# Altium project flyback_desing.PrjPcb
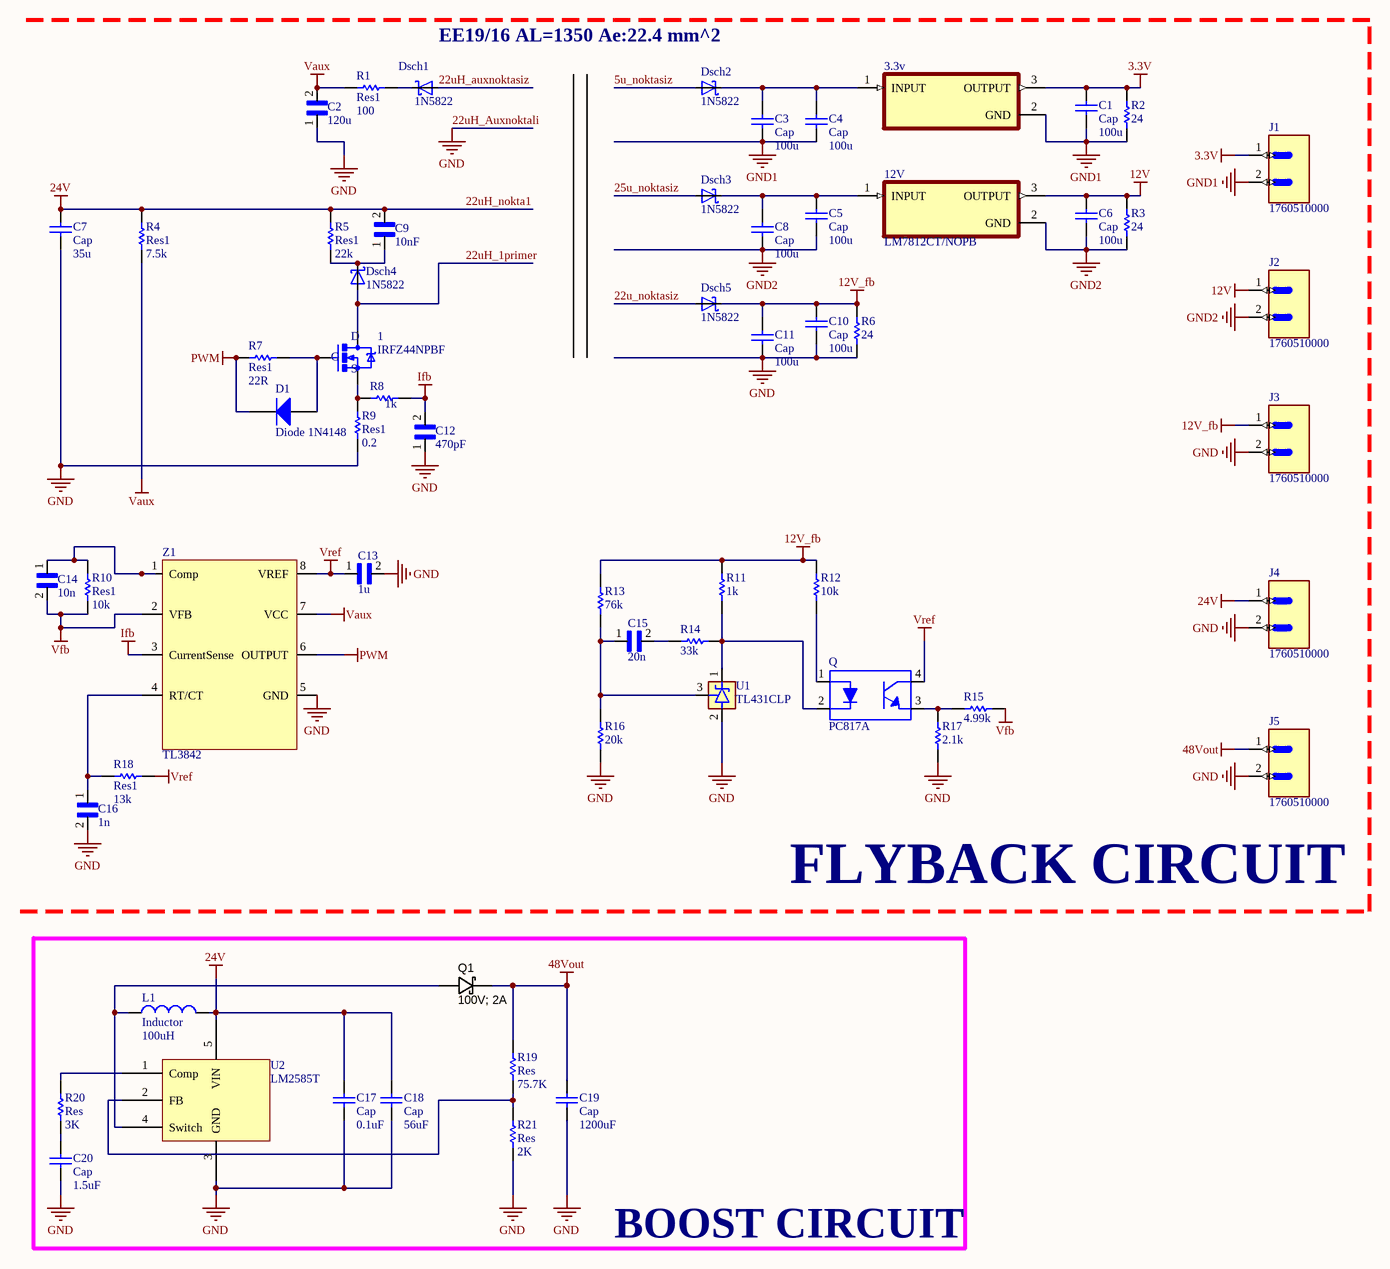
[diagram p0: flyback_sematik.SchDoc]
2 sheets, 61 parts. Net scope: global (net labels, ports and power ports of the same name join across sheets).
Board file: flyback_pcbdesing.PcbDoc
Sheets:
  flyback_sematik.SchDoc
  boost_sematik.SchDoc

## Sheet flyback_sematik.SchDoc: Flyback & Boost Circuits
size A3; DrawnBy: Zeynep Saklı

### Parts
1  IRFZ44NPBF  [TO-220]
3.3v  LM7812CT/NOPB  [TO254P1054X470X1955-3]  (value not drawn)
12V  LM7812CT/NOPB  [TO254P1054X470X1955-3]
C1  Cap  value 100u  [Cap1]
C2  120u  [CAP_RCER72A472K0A2H03B]
C3  Cap  value 100u  [Cap1]
C4  Cap  value 100u  [Cap1]
C5  Cap  value 100u  [Cap1]
C6  Cap  value 100u  [Cap1]
C7  Cap  value 35u  [Cap1]
C8  Cap  value 100u  [Cap1]
C9  10nF  [CAP_RCER72A472K0A2H03B]
C10  Cap  value 100u  [Cap1]
C11  Cap  value 100u  [Cap1]
C12  470pF  [CAP_RCER72A472K0A2H03B]
C13  1u  [CAP_RCER72A472K0A2H03B]
C14  10n  [CAP_RCER72A472K0A2H03B]
C15  20n  [CAP_RCER72A472K0A2H03B]
C16  1n  [CAP_RCER72A472K0A2H03B]
C17  Cap  value 0.1uF  [Cap1]
C18  Cap  value 56uF  [Cap1]
C19  Cap  value 1200uF  [Cap1]
C20  Cap  value 1.5uF  [Cap1]
D1  Diode 1N4148  [DO-35]
Dsch1  1N5822  [DIOAD2120W130L950D530P]
Dsch2  1N5822  [DIOAD2120W130L950D530P]
Dsch3  1N5822  [DIOAD2120W130L950D530P]
Dsch4  1N5822  [DIOAD2120W130L950D530P]
Dsch5  1N5822  [DIOAD2120W130L950D530P]
J1  1760510000  [1760490000]
J2  1760510000  [1760490000]
J3  1760510000  [1760490000]
J4  1760510000  [1760490000]
J5  1760510000  [1760490000]
L1  Inductor  value 100uH  [Inductor2]
Q  PC817A  [DIP762W50P254L650H458Q4B]
Q1  Ratings: 100V; 2A  [Schottky]  (hidden comment: DIODE_SCHOTTKY_10MQ100NPBF)
R1  Res1  value 100  [AXIAL-0.3]
R2  value 24  [AXIAL-0.3]  (hidden comment: Res1)
R3  value 24  [AXIAL-0.3]  (hidden comment: Res1)
R4  Res1  value 7.5k  [AXIAL-0.3]
R5  Res1  value 22k  [AXIAL-0.3]
R6  value 24  [AXIAL-0.3]  (hidden comment: Res1)
R7  Res1  value 22R  [AXIAL-0.3]
R8  value 1k  [AXIAL-0.3]  (hidden comment: Res1)
R9  Res1  value 0.2  [AXIAL-0.3]
R10  Res1  value 10k  [AXIAL-0.3]
R11  value 1k  [AXIAL-0.3]  (hidden comment: Res1)
R12  value 10k  [AXIAL-0.3]  (hidden comment: Res1)
R13  value 76k  [AXIAL-0.3]  (hidden comment: Res1)
R14  value 33k  [AXIAL-0.3]  (hidden comment: Res1)
R15  value 4.99k  [AXIAL-0.3]  (hidden comment: Res1)
R16  value 20k  [AXIAL-0.3]  (hidden comment: Res1)
R17  value 2.1k  [AXIAL-0.3]  (hidden comment: Res1)
R18  Res1  value 13k  [AXIAL-0.3]
R19  Res  value 75.7K  [AXIAL-0.3]
R20  Res  value 3K  [AXIAL-0.3]
R21  Res  value 2K  [AXIAL-0.3]
U1  TL431CLP  [TO-92]
U2  LM2585T  [LM2585T]
Z1  TL3842  [TL3842_PCBLIB]

### Nets
3.3V: 3.3v.3(OUTPUT) C1.1 J1.1 R2.2
12V: 12V.3(OUTPUT) C6.1 J2.1 R3.2
12V_fb: C10.1 C11.1 Dsch5.C J3.1 R6.2 R11.2 R12.2 R13.2
22uH_Auxnoktali: C2.1 C7.2 C10.2 C11.2 C12.1 C13.2 C16.2 C17.2 C18.2 C19.2 C20.2 J3.2 J4.2 J5.2 R6.1 R9.2 R16.1 R17.2 R21.1 U1.2(ANODE) U2.3(GND) Z1.5(GND)  [also labelled GND]
22uH_nokta1: C7.1 C9.2 C17.1 C18.1 J4.1 L1.2 R4.1 R5.1 U2.5(VIN)  [also labelled 24V]
48Vout: C19.1 J5.1 Q1.2 R19.2
GND1: 3.3v.2(GND) C1.2 C3.2 C4.2 J1.2 R2.1
GND2: 12V.2(GND) C5.2 C6.2 C8.2 J2.2 R3.1
Ifb: C12.2 R8.2 Z1.3(CurrentSense)
PWM: D1.2(K) R7.1 Z1.6(OUTPUT)
Vaux: C2.2 R1.2 R4.2 Z1.7(VCC)
Vfb: C14.2 R10.1 R15.1 Z1.2(VFB)
Vref: C13.1 Q.4 R18.2 Z1.8(VREF)
5u_noktasiz: Dsch2.A
22u_noktasiz: Dsch5.A
22uH_1primer: 1.2(D) Dsch4.A
22uH_auxnoktasiz: Dsch1.A
25u_noktasiz: Dsch3.A
Net1_1: 1.1(G) D1.1(A) R7.2
Net1_3: 1.3(S) R8.1 R9.1
Net3.3v_1: 3.3v.1(INPUT) C3.1 C4.1 Dsch2.C
Net12V_1: 12V.1(INPUT) C5.1 C8.1 Dsch3.C
NetC9_1: C9.1 Dsch4.C R5.2
NetC14_1: C14.1 R10.2 Z1.1(Comp)
NetC15_1: C15.1 R13.1 R16.2 U1.3(REF)
NetC15_2: C15.2 R14.2
NetC16_1: C16.1 R18.1 Z1.4(RT/CT)
NetC20_1: C20.1 R20.1
NetDsch1_C: Dsch1.C R1.1
NetL1_1: L1.1 Q1.1 U2.4(Switch)
NetQ_1: Q.1 R12.1
NetQ_2: Q.2 R11.1 R14.1 U1.1(CATHODE)
NetQ_3: Q.3 R15.2 R17.1
NetR19_1: R19.1 R21.2 U2.2(FB)
NetR20_2: R20.2 U2.1(Comp)

### Notes on the sheet
- EE19/16 AL=1350 Ae:22.4 mm^2
- FLYBACK CIRCUIT
- BOOST CIRCUIT

### Library data of the parts
1 = IRFZ44NPBF: RoHS Compliant | Low RDS_on_ | Industry-leading quality | Dynamic dv/dt Rating | Fast Switching | Fully Avalanche Rated | 175C Operating Temperature; MF: Infineon; MP: IRFZ44NPBF; Price: None; SnapEDA_Link: https://www.snapeda.com/parts/IRFZ44NPBF/Infineon%20Technologies/view-part/1662576/?ref=snap; Package: TO-220 Infineon; Value: *; Availability: Unavailable
3.3v 12V = LM7812CT/NOPB: 1.5-A, 30-V, linear voltage regulator 3-TO-220 -40 to 125; MF: Texas Instruments; Value: *; SnapEDA_Link: https://www.snapeda.com/parts/LM7812CT/NOPB/Texas%20Instruments/view-part/7142/?ref=snap; Texas_Instruments-Purchase-URL: https://snapeda.com/shop?store=Texas+Instruments&id=7142; Mouser-Purchase-URL: https://snapeda.com/shop?store=Mouser&id=7142; Availability: Good; Price: None; Package: TO-220-3 Texas Instruments; DigiKey-Purchase-URL: https://snapeda.com/shop?store=DigiKey&id=7142; MP: LM7812CT/NOPB
C1 C3-C8 C10 C11 C17-C20 = Cap: Capacitor; Published: 8-Jun-2000; LatestRevisionDate: 17-Jul-2002; LatestRevisionNote: Re-released for DXP Platform.; PackageReference: RAD-0.3; Publisher: Altium Limited; PackageDescription: Radial Cap, Thru-Hole; 2 Leads; 0.3 in Pin Spacing
C2 C9 C12-C16 = RCER72A472K0A2H03B: Cap Ceramic 1pF 50V C0G 0.25pF Radial 2.5mm 125C Automotive Bulk; Package: None; Price: None; Value: *; MP: RCER72A472K0A2H03B; Availability: Unavailable
D1 = Diode 1N4148: High Conductance Fast Diode; Published: 8-Jun-2000; LatestRevisionDate: 17-Jul-2002; LatestRevisionNote: Re-released for DXP Platform.; DatasheetVersion: 1997; PackageReference: DO-35; Publisher: Altium Limited; PackageDescription: Diode, Axial; Body 3.8 x 1.9 mm (LxDia. max), Lead Dia. 0.53 mm (max); Code_JEDEC: DO-204-AH; ComponentLink1Description: Manufacturer Link; ComponentLink1URL: http://www.fairchildsemi.com/; ComponentLink2Description: Datasheet; ComponentLink2URL: http://www.fairchildsemi.com/ds/1N%2F1N4148.pdf
Dsch1-Dsch5 = 1N5822: Diode Schottky 40V 3A Through Hole; MF: ON Semiconductor; Package: DO-201AD-201 Panjit; MP: 1N5822; Value: *; SnapEDA_Link: https://www.snapeda.com/parts/1N5822/ON%20Semiconductor/view-part/1356736/?ref=snap; Price: None; Availability: Unavailable
J1-J5 = 1760510000: 2 Position Wire to Board Terminal Block Horizontal with Board 0.200 _5.08mm_ Through Hole; MF: Weidmuller; Package: None; Price: None; SnapEDA_Link: https://www.snapeda.com/parts/1760510000/Weidmuller/view-part/286722/?ref=snap; Availability: Unavailable; Value: *; MP: 1760510000
L1 = Inductor: Code_IEC: 1005; Published: 8-Jun-2000; LatestRevisionDate: 29-May-2009; LatestRevisionNote: IPC-7351 Footprint Added.; PackageReference: 0402-A; Publisher: Altium Limited; PackageDescription: Chip Inductor; Code_JEITA: 0402
Q = PC817A: Optoisolator Transistor Output 5000Vrms 1 Channel 4-DIP; MF: Taiwan Semiconductor; Availability: Unavailable; Package: DIP-4 Taiwan Semiconductor; SnapEDA_Link: https://www.snapeda.com/parts/PC817A/Taiwan%20Semiconductor%20Corporation/view-part/2178336/?ref=snap; MP: PC817A; Price: None; Value: *
Q1 = DIODE_SCHOTTKY_10MQ100NPBF: Diode Schottky SMD 100V 2A SMA; Manufacturer 1: Micro Commercial Co; Manufacturer Part Number 1: SS210-TP; Material: Si; Speed: Fast Recovery =< 500ns, > 200mA (Io); SCDType: source; Package / Case: DO-214AC, SMA; Diode Type: Schottky; Mounting Type: Surface Mount; Supplier 1: Digi-Key; Supplier Part Number 1: SS210-TPMSCT-ND
R1-R21 = Res1: Resistor; Published: 8-Jun-2000; LatestRevisionDate: 17-Jul-2002; LatestRevisionNote: Re-released for DXP Platform.; PackageReference: AXIAL-0.3; Publisher: Altium Limited; PackageDescription: Axial Device, Thru-Hole; 2 Leads; 0.3 in Pin Spacing
U1 = TL431CLP: Adjustable precision shunt regulator 3-TO-92 0 to 70; MF: Texas Instruments; Purchase-URL: https://pricing.snapeda.com/search/part/TL431CLP/?ref=eda; Price: None; Package: TO-92 Texas Instruments; Check_prices: https://www.snapeda.com/parts/TL431CLP/Texas%20Instruments/view-part/4478972/?ref=eda; Value: *; MP: TL431CLP; Availability: Good; SnapEDA_Link: https://www.snapeda.com/parts/TL431CLP/Texas%20Instruments/view-part/4478972/?ref=snap

## Sheet boost_sematik.SchDoc
size A4